# Altium project H2_receiver_v1.PrjPcb
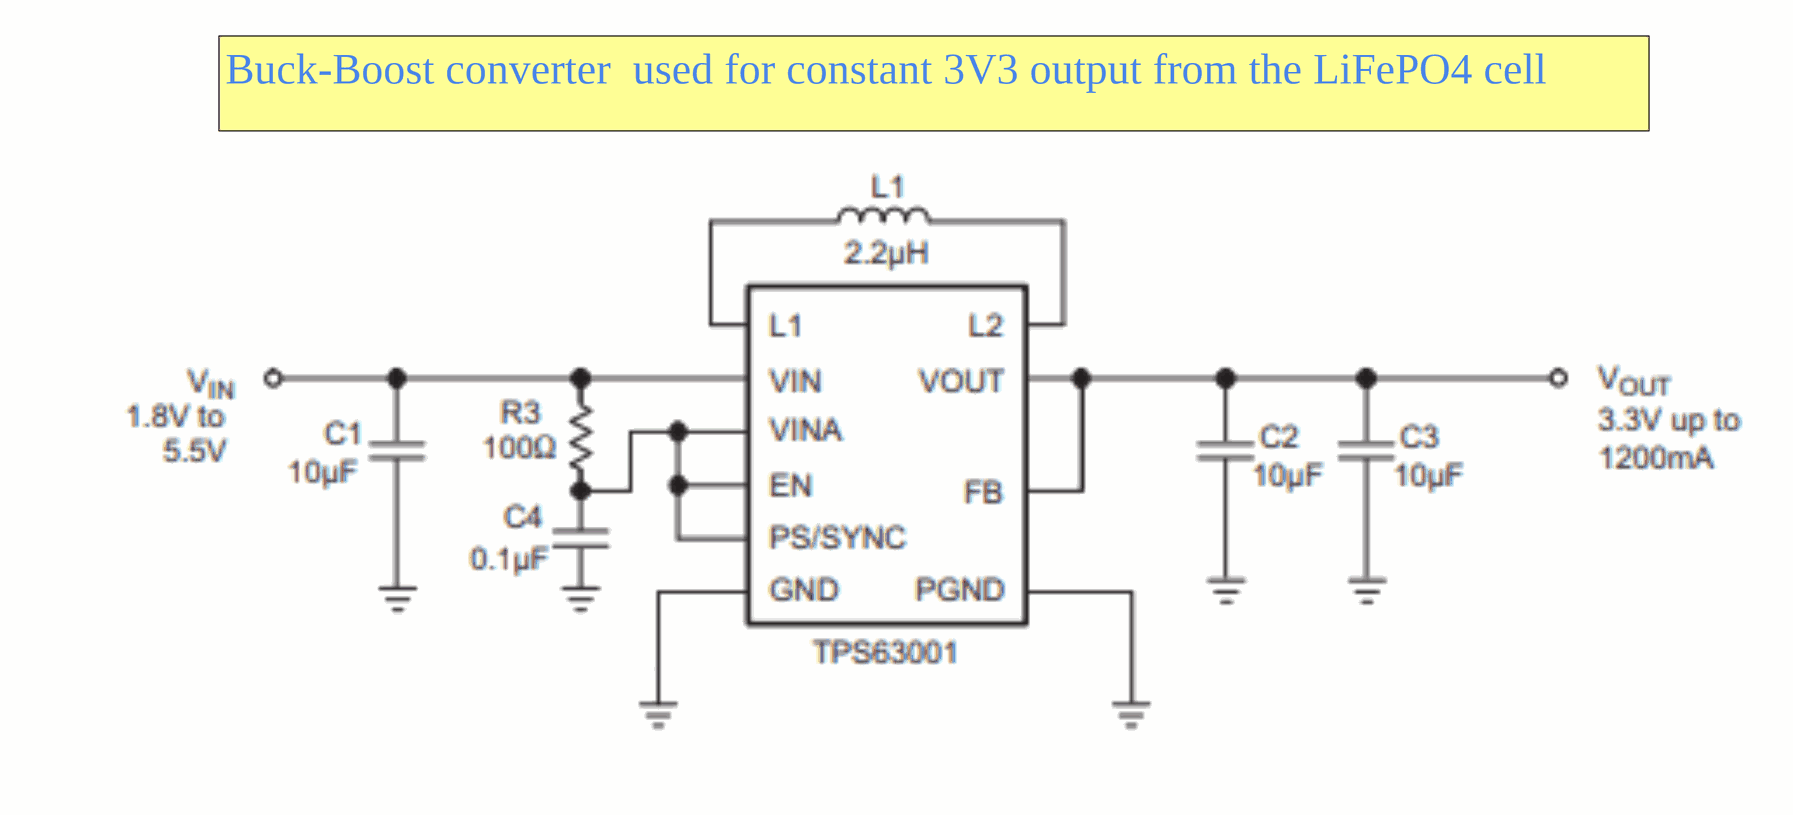
[diagram p0: 1_Power.SchDoc, top left]
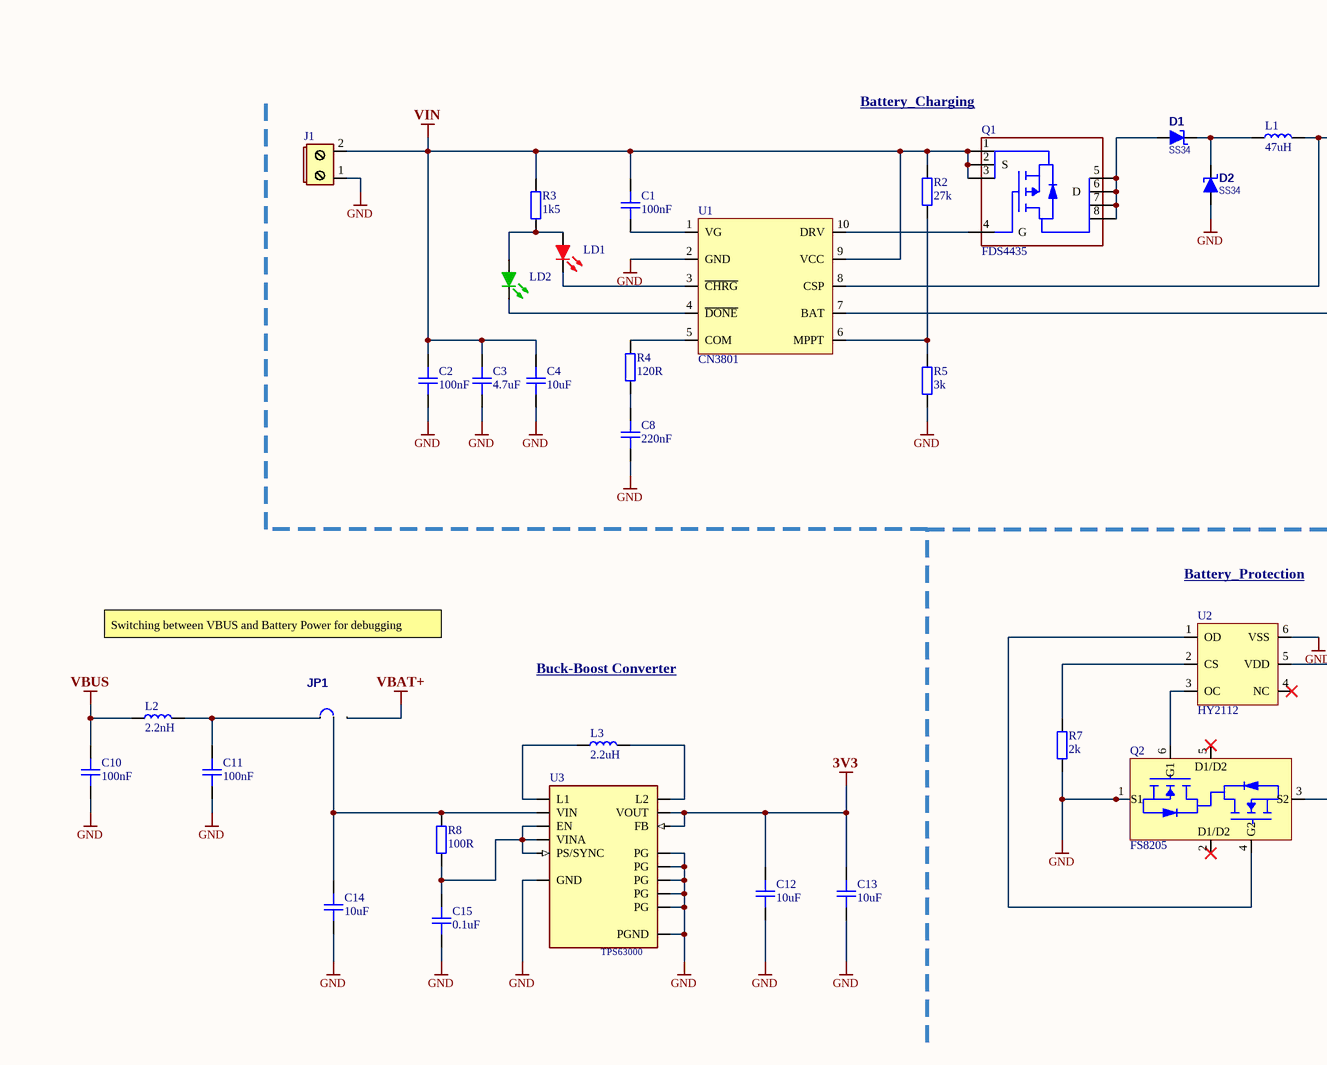
[diagram p1: 1_Power.SchDoc, top middle]
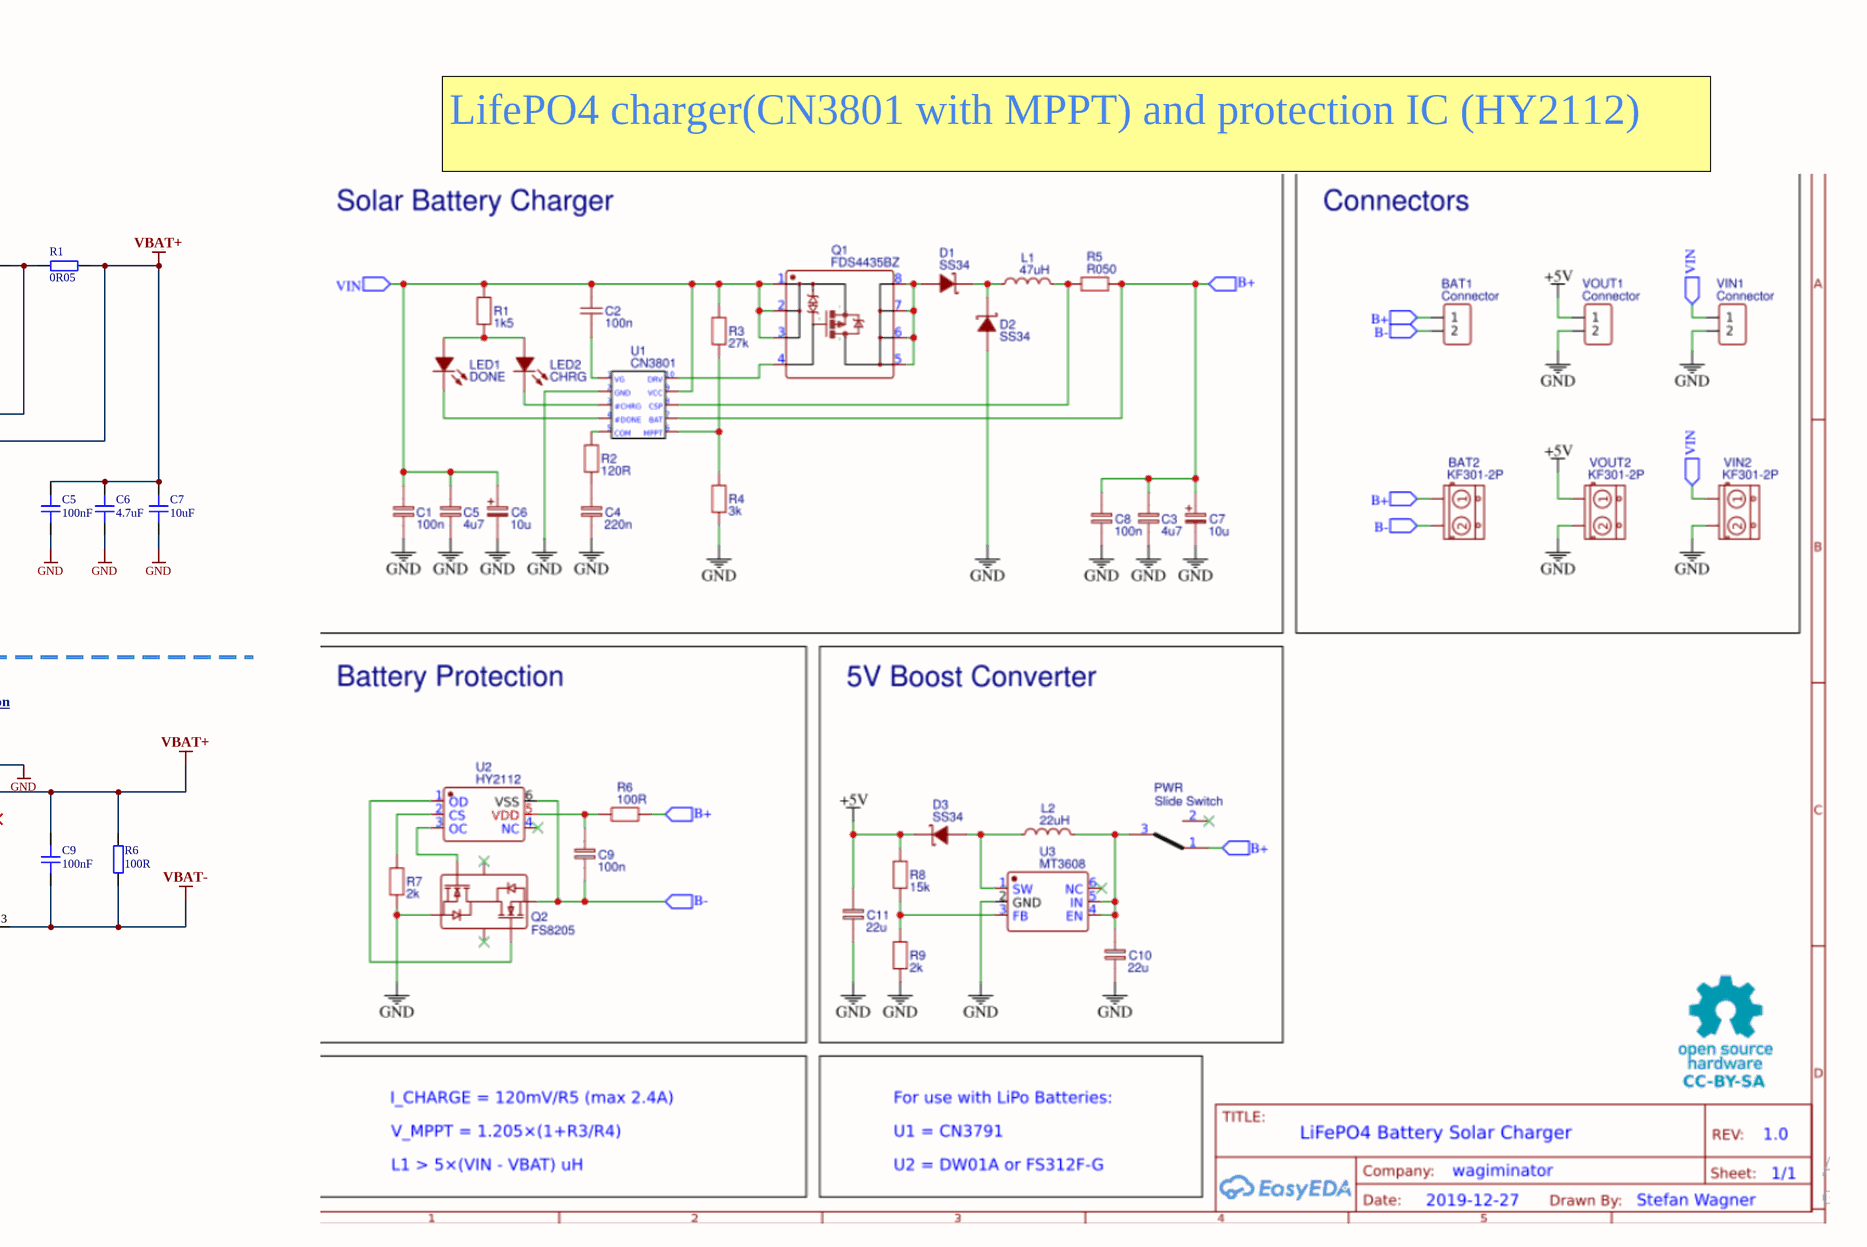
[diagram p2: 1_Power.SchDoc, top right]
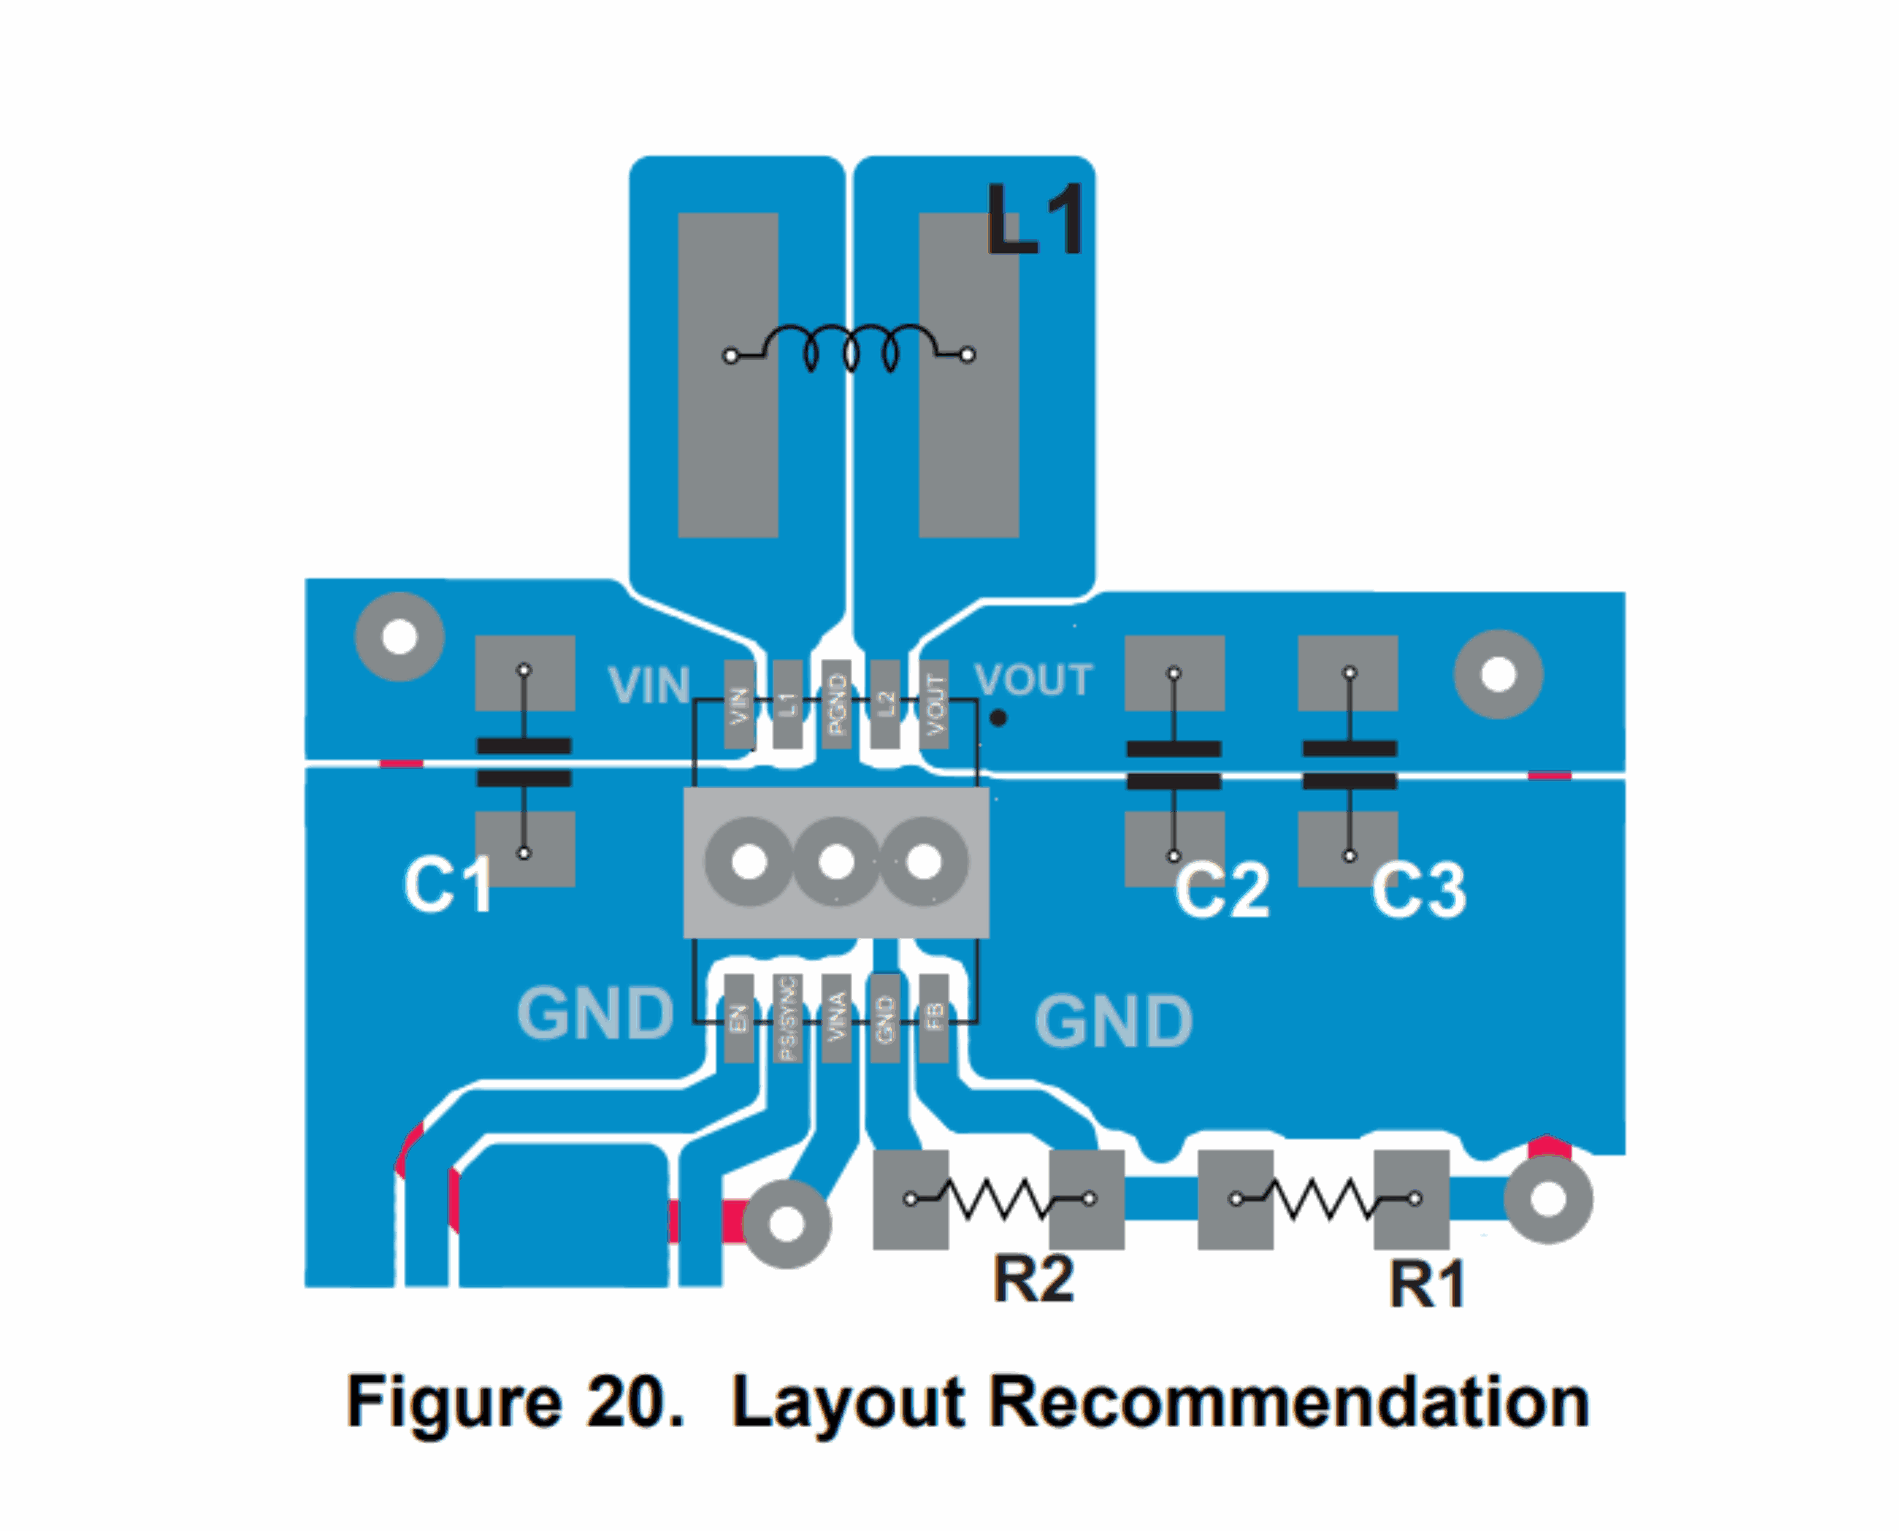
[diagram p3: 1_Power.SchDoc, bottom left]
2 sheets, 45 parts. Net scope: flat (ports and power ports of the same name join across sheets).
Sheets:
  1_Power.SchDoc
  4_SD_Card_NFC.SchDoc

## Sheet 1_Power.SchDoc
size A4; SheetNumber: 1; SheetTotal: 4

### Parts
C1  100nF  [CAP_0603]
C2  100nF  [CAP_0603]
C3  4.7uF  [CAP_0603]
C4  10uF  [CAP_0805]
C5  100nF  [CAP_0603]
C6  4.7uF  [CAP_0603]
C7  10uF  [CAP_0805]
C8  220nF  [CAP_0603]
C9  100nF  [CAP_0603]
C10  100nF  [CAP_0603]
C11  100nF  [CAP_0603]
C12  10uF  [CAP_0805]
C13  10uF  [CAP_0805]
C14  10uF  [CAP_0805]
C15  0.1uF  [CAP_0603]
D1  SS34  [DO-213AA]
D2  SS34  [DO-213AA]
J1  PLUGIN_TERMINAL  (value not drawn)
JP1  JUMPER_3PIN  [JUMPER_SMD_3]  (value not drawn)
L1  47uH  [IND_0603]
L2  2.2nH  [IND_1008]
L3  2.2uH  [IND_1008]
LD1  LED_RED  [3.5X2.8X1.9]  (value not drawn)
LD2  LED_GREEN  [3.5X2.8X1.9]  (value not drawn)
Q1  FDS4435
Q2  FS8205
R1  0R05  [RES_0805]
R2  27k  [RES_0603]
R3  1k5  [RES_0603]
R4  120R  [RES_0603]
R5  3k  [RES_0603]
R6  100R  [RES_0603]
R7  2k  [RES_0603]
R8  100R  [RES_0603]
U1  CN3801
U2  HY2112
U3  TPS63000_1  [10-VFDFN]  (value not drawn)

### Nets
3V3: C12.2 C13.2 U3.1(VOUT) U3.10(FB)
GND: C2.1 C3.1 C4.1 C5.1 C6.1 C7.1 C8.1 C10.1 C11.1 C12.1 C13.1 C14.1 C15.1 D2.1(A) J1.1 Q2.1(S1) R5.1 R7.1 U1.2(GND) U2.6(VSS) U3.3(PGND) U3.9(GND) U3.P$1(PG) U3.P$2(PG) U3.P$3(PG) U3.P$4(PG) U3.P$5(PG)
VBAT+: C5.2 C6.2 C7.2 C9.2 JP1.3 R1.2 R6.2 U1.7(BAT) U2.5(VDD)
VBAT-: C9.1 Q2.3(S2) R6.1
VBUS: C10.2 L2.1
VIN: C1.2 C2.2 C3.2 C4.2 J1.2 Q1.1(S) Q1.2(S) Q1.3(S) R2.2 R3.2 U1.9(VCC)
NetC1_1: C1.1 U1.1(VG)
NetC8_2: C8.2 R4.1
NetC11_2: C11.2 JP1.1 L2.2
NetC14_2: C14.2 JP1.2 R8.2 U3.5(VIN)
NetC15_2: C15.2 R8.1 U3.6(EN) U3.7(PS/SYNC) U3.8(VINA)
NetD1_1: D1.1(A) Q1.5(D) Q1.6(D) Q1.7(D) Q1.8(D)
NetD1_2: D1.2(K) D2.2(K) L1.1
NetL1_2: L1.2 R1.1 U1.8(CSP)
NetL3_1: L3.1 U3.4(L1)
NetL3_2: L3.2 U3.2(L2)
NetLD1_1: LD1.1(A) LD2.1(A) R3.1
NetLD1_2: LD1.2(K) U1.3(~{CHRG})
NetLD2_2: LD2.2(K) U1.4(~{DONE})
NetQ1_4: Q1.4(G) U1.10(DRV)
NetQ2_4: Q2.4(G2) U2.1(OD)
NetQ2_6: Q2.6(G1) U2.3(OC)
NetR2_1: R2.1 R5.2 U1.6(MPPT)
NetR4_2: R4.2 U1.5(COM)
NetR7_2: R7.2 U2.2(CS)

Not connected (* = marked no-connect by the designer): Q2 2(D1/D2)* 5(D1/D2)*; U2 4(NC)*

### Notes on the sheet
- Buck-Boost converter  used for constant 3V3 output from the LiFePO4 cell
- LifePO4 charger(CN3801 with MPPT) and protection IC (HY2112)
- Battery_Charging
- Switching between VBUS and Battery Power for debugging
- Battery_Protection
- Overcharge, Overdischarge, Overcurrent, Short-circuit protection
- Buck-Boost Converter

### Library data of the parts
C1-C3 C5 C6 C8-C11 C15 = CAP_0603: Capacitor SMD 0603; Manufacturer: *; Manufacturer Part Number: *; Distributor Link: *; LCSC: *; Rating: *; Dielectric: *
C4 C7 C12-C14 = CAP_0805: Capacitor SMD 0805; Manufacturer: *; Manufacturer Part Number: *; Distributor Link: *; LCSC: *; Rating: *; Dielectric: *
D1 D2 = DIODE_SCHOTTKY: Diode; Manufacturer Part Number 1: *; PackageReference: *
J1 = Power_Connector: Screw terminal or plug terminal for power
JP1 = JUMPER_3PIN: *; PackageReference: *; Manufacturer Part Number 1: *
L1 = IND_0603: Inductor SMD 0603
L2 L3 = IND_1008: Inductor SMD 1008
LD1 = LED_RED: Typical BLUE SiC LED; Published: 8-Jun-2000; LatestRevisionDate: 17-Dec-2003; LatestRevisionNote: PCB Footprint replaced.; DatasheetVersion: 16-Apr-2002; PackageVersion: 16-Apr-2002; Publisher: Altium Limited; PackageDescription: SM LED; 2 C-Bend Leads; Body 3.5 x 2.8 x 1.9 mm, inc leads (LxWxH typ); Manufacturer Part Number 1: *; PackageReference: 3.5X2.8X1.9
LD2 = LED_GREEN: Typical BLUE SiC LED; Published: 8-Jun-2000; LatestRevisionDate: 17-Dec-2003; LatestRevisionNote: PCB Footprint replaced.; DatasheetVersion: 16-Apr-2002; PackageVersion: 16-Apr-2002; Publisher: Altium Limited; PackageDescription: SM LED; 2 C-Bend Leads; Body 3.5 x 2.8 x 1.9 mm, inc leads (LxWxH typ); Manufacturer Part Number 1: *; PackageReference: 3.5X2.8X1.9
R1 = RES_0805: Resistor SMD 0805; Manufacturer: *; Manufacturer Part Number: *; Distributor Link: *; LCSC: *
R2-R6 R8 = RES_0603: Resistor SMD 0603; Manufacturer: *; Manufacturer Part Number: *; Distributor Link: *; LCSC: *
R7 = RES_0603_1: Resistor SMD 0603; Manufacturer: *; Manufacturer Part Number: *; Distributor Link: *; LCSC: *
U1 = CN3801: LiFePO4 charge IC with integrated MPPT and wide input range (4.5 to 28V) with deeply discharged cell revive
U2 = HY2112: LiFePO4 protection IC
U3 = TPS63000_1: Buck-Boost Switching Regulator IC Positive Adjustable 1.2V 1 Output 1.6A _Switch_ 10-VFDFN Exposed Pad; MF: Texas Instruments; Package: QFN-10 Texas Instruments; SnapEDA_Link: https://www.snapeda.com/parts/TPS63000/Texas%20Instruments/view-part/572521/?ref=snap; MP: TPS63000; Value: *; Availability: Unavailable; Price: None

## Sheet 4_SD_Card_NFC.SchDoc
size A4; SheetNumber: 4; SheetTotal: 4
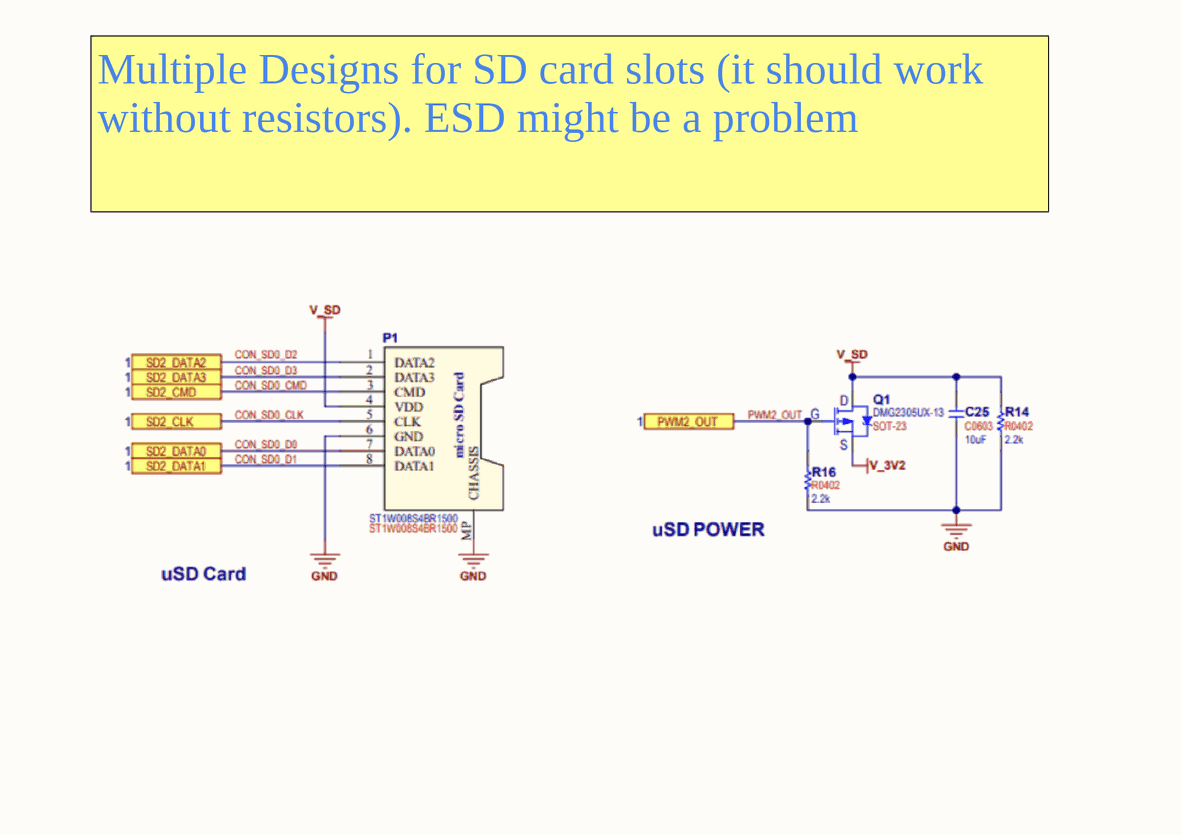
[diagram p4: 4_SD_Card_NFC.SchDoc, top middle]
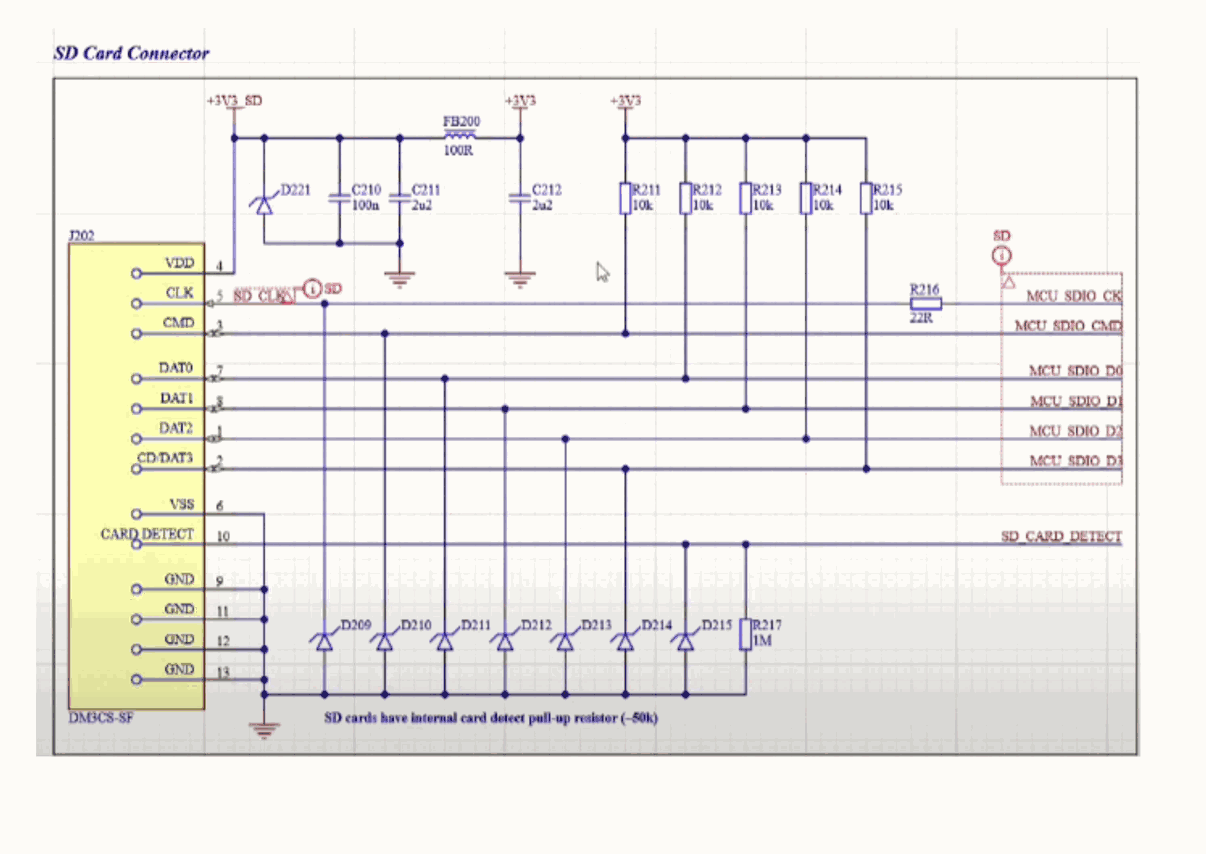
[diagram p5: 4_SD_Card_NFC.SchDoc, bottom left]
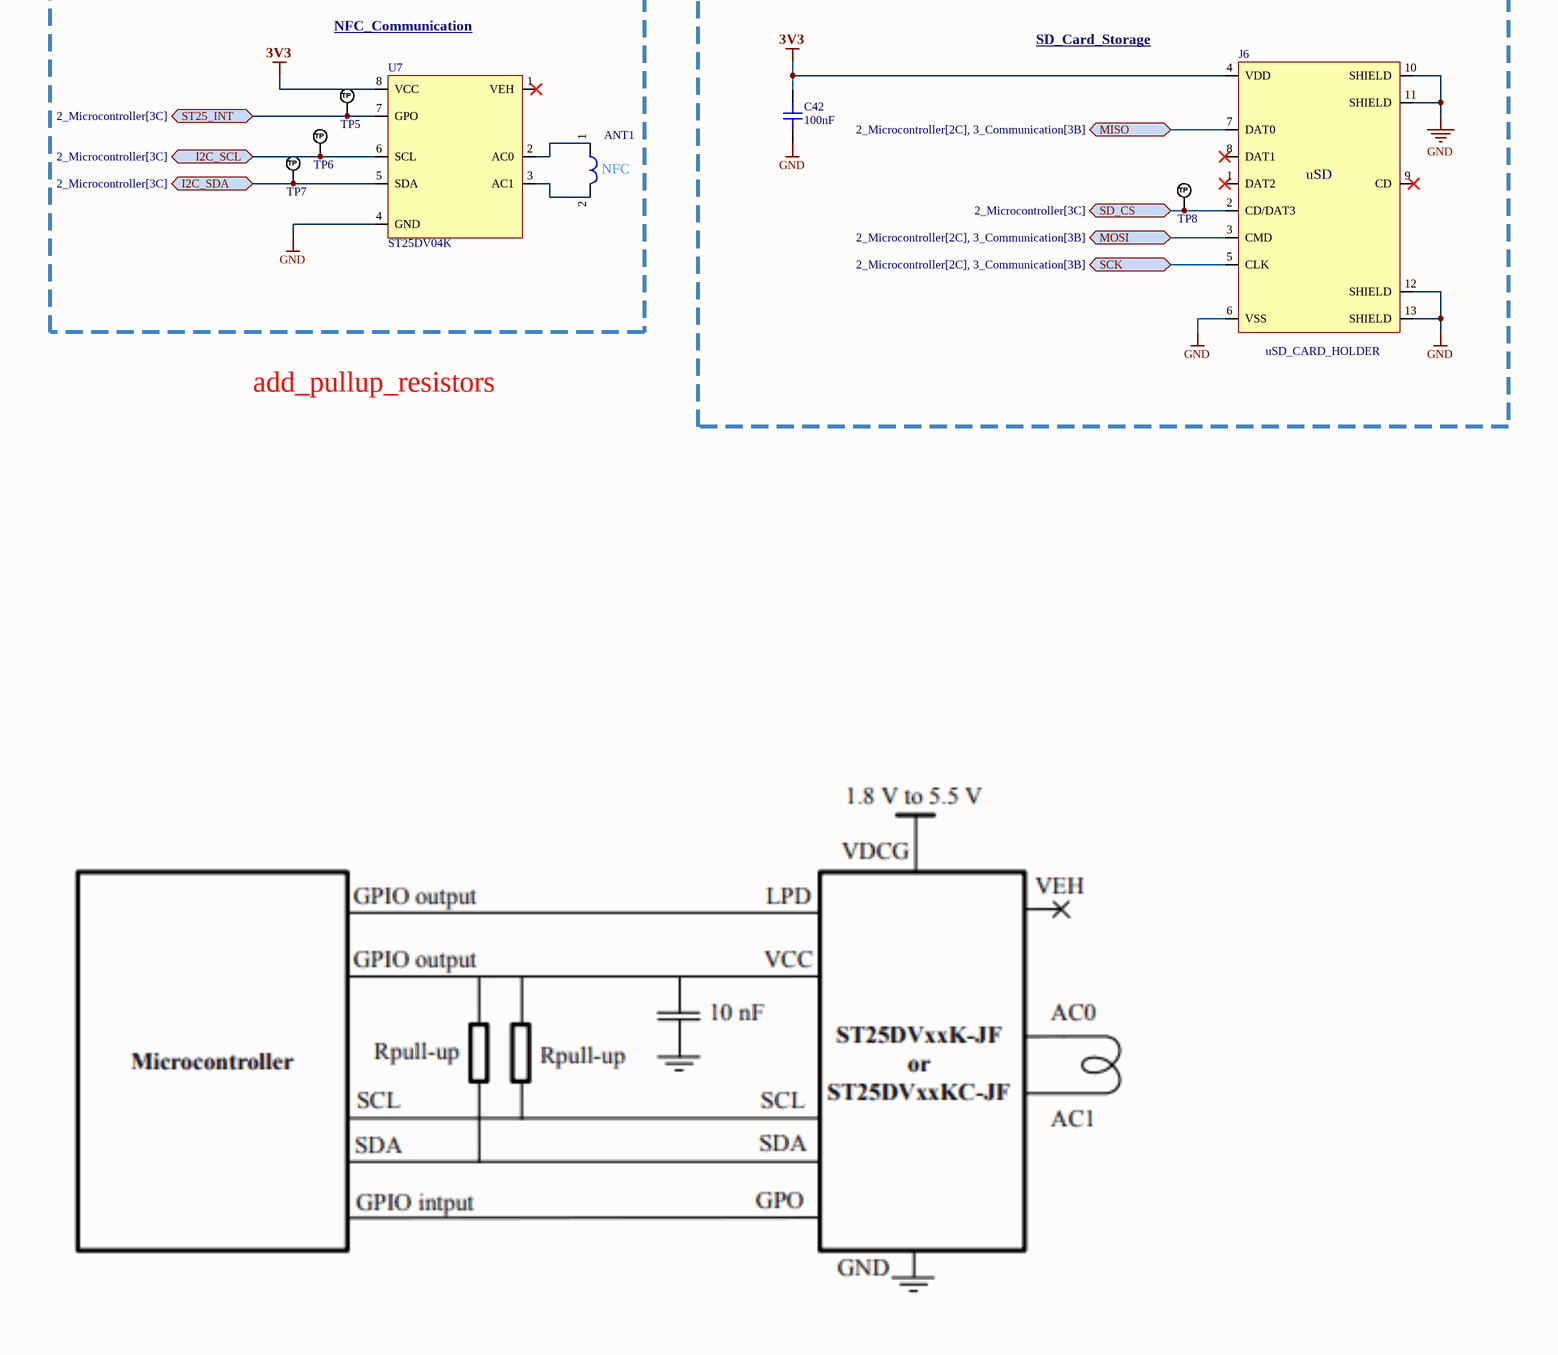
[diagram p6: 4_SD_Card_NFC.SchDoc, bottom middle]
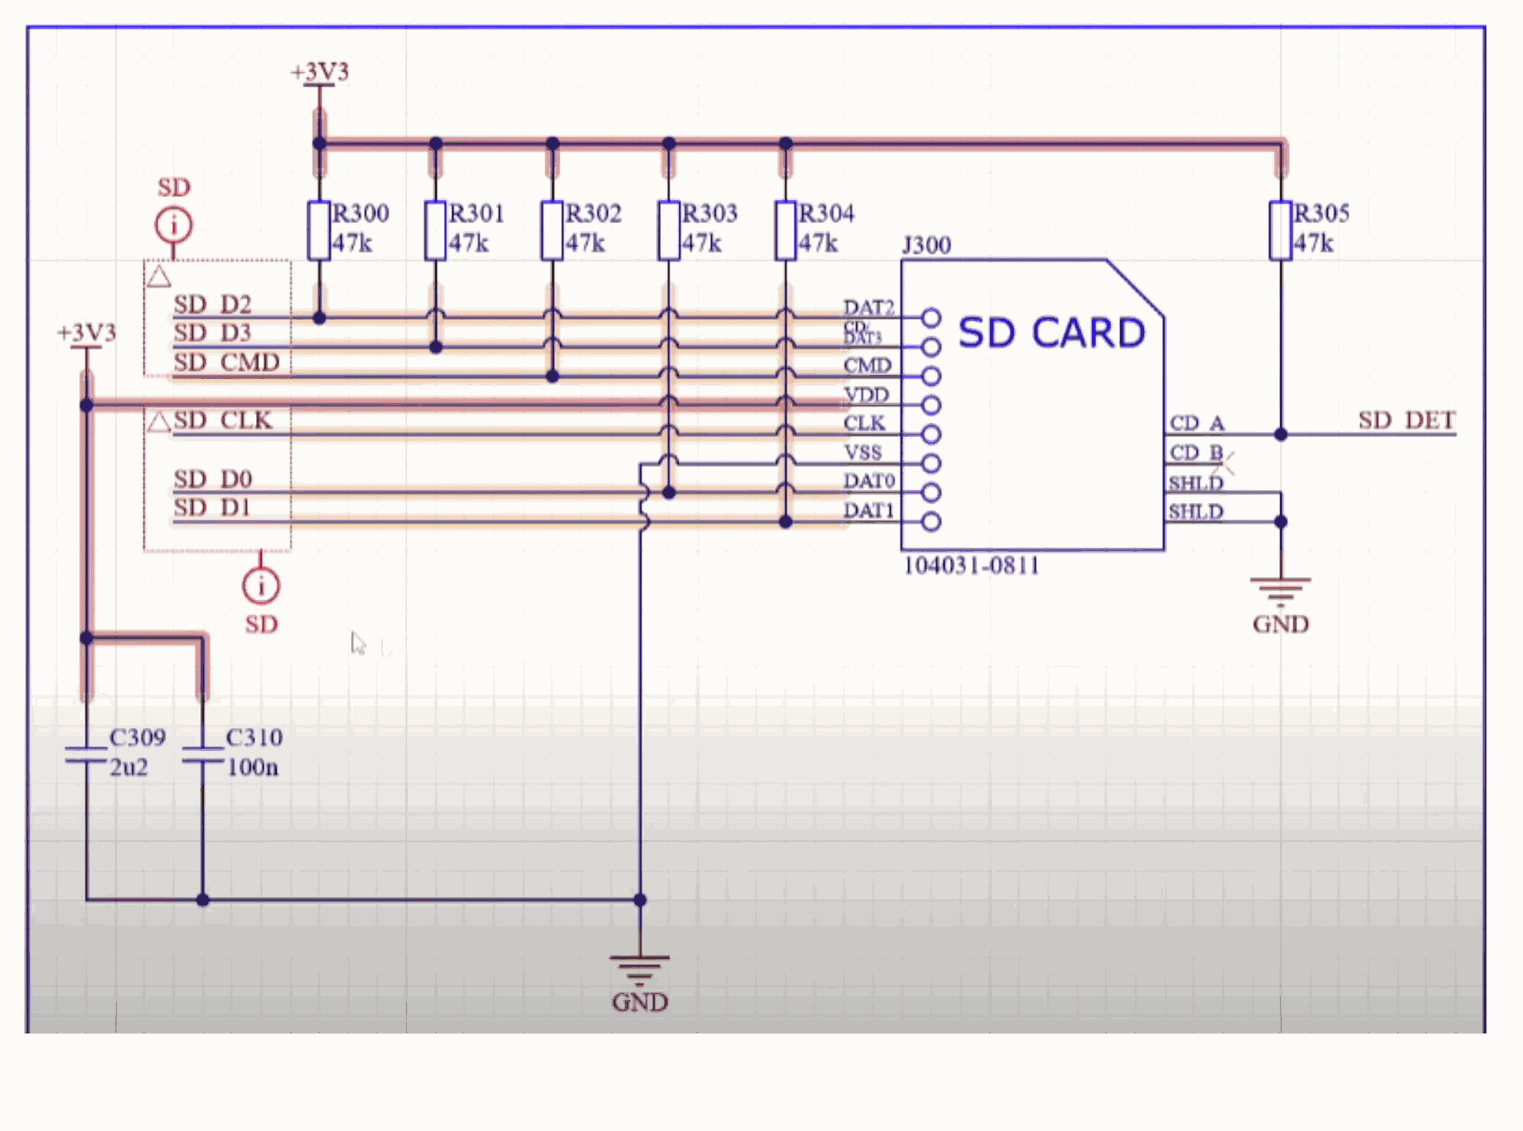
[diagram p7: 4_SD_Card_NFC.SchDoc, bottom right]

### Parts
ANT1  NFC_ANTENNA  (value not drawn)
C42  100nF  [CAP_0603]
J6  uSD_CARD_HOLDER
TP5  TP_NOBOM  [PAD_RND_1MM]  (value not drawn)  (no BOM)
TP6  TP_NOBOM  [PAD_RND_1MM]  (value not drawn)  (no BOM)
TP7  TP_NOBOM  [PAD_RND_1MM]  (value not drawn)  (no BOM)
TP8  TP_NOBOM  [PAD_RND_1MM]  (value not drawn)  (no BOM)
U7  ST25DV04K

### Ports
I2C_SCL (bidir, see 2_Microcontroller[3C]), I2C_SDA (bidir, see 2_Microcontroller[3C]), MISO (bidir, see 2_Microcontroller[2C], 3_Communication[3B]), MOSI (bidir, see 2_Microcontroller[2C], 3_Communication[3B]), SCK (bidir, see 2_Microcontroller[2C], 3_Communication[3B]), SD_CS (bidir, see 2_Microcontroller[3C]), ST25_INT (bidir, see 2_Microcontroller[3C])

### Nets
3V3: C42.2 J6.4(VDD) U7.8(VCC)
GND: C42.1 J6.6(VSS) J6.10(SHIELD) J6.11(SHIELD) J6.12(SHIELD) J6.13(SHIELD) U7.4(GND)
NetANT1_1: ANT1.1 U7.2(AC0)
NetANT1_2: ANT1.2 U7.3(AC1)
NetJ6_2: J6.2(CD/DAT3) TP8.1(TP) ; port SD_CS
NetJ6_3: J6.3(CMD) ; port MOSI
NetJ6_5: J6.5(CLK) ; port SCK
NetJ6_7: J6.7(DAT0) ; port MISO
NetTP5_1: TP5.1(TP) U7.7(GPO) ; port ST25_INT
NetTP6_1: TP6.1(TP) U7.6(SCL) ; port I2C_SCL
NetTP7_1: TP7.1(TP) U7.5(SDA) ; port I2C_SDA

Not connected (* = marked no-connect by the designer): J6 1(DAT2)* 8(DAT1)* 9(CD)*; U7 1(VEH)*

### Notes on the sheet
- Multiple Designs for SD card slots (it should work without resistors). ESD might be a problem
- NFC_Communication
- SD_Card_Storage
- add_pullup_resistors
- (in symbol NFC_ANTENNA) NFC
- (in symbol uSD_CARD) uSD

### Library data of the parts
C42 = CAP_0603: Capacitor SMD 0603; Manufacturer: *; Manufacturer Part Number: *; Distributor Link: *; LCSC: *; Rating: *; Dielectric: *
J6 = uSD_CARD
TP5-TP8 = TEST_POINT_RND_1MM: Test Point Round 1mm (NO BOM)
U7 = ST25DV04K: ST25DO4K NFC module with I2C

## Nets that join several sheets
3V3: 1_Power (C12.2 C13.2 U3.1 U3.10), 4_SD_Card_NFC (C42.2 J6.4 U7.8)
GND: 1_Power (27 pins), 4_SD_Card_NFC (7 pins)